# EAGLE schematic EMG_Shield_v.1.2 (EAGLE 6.2)
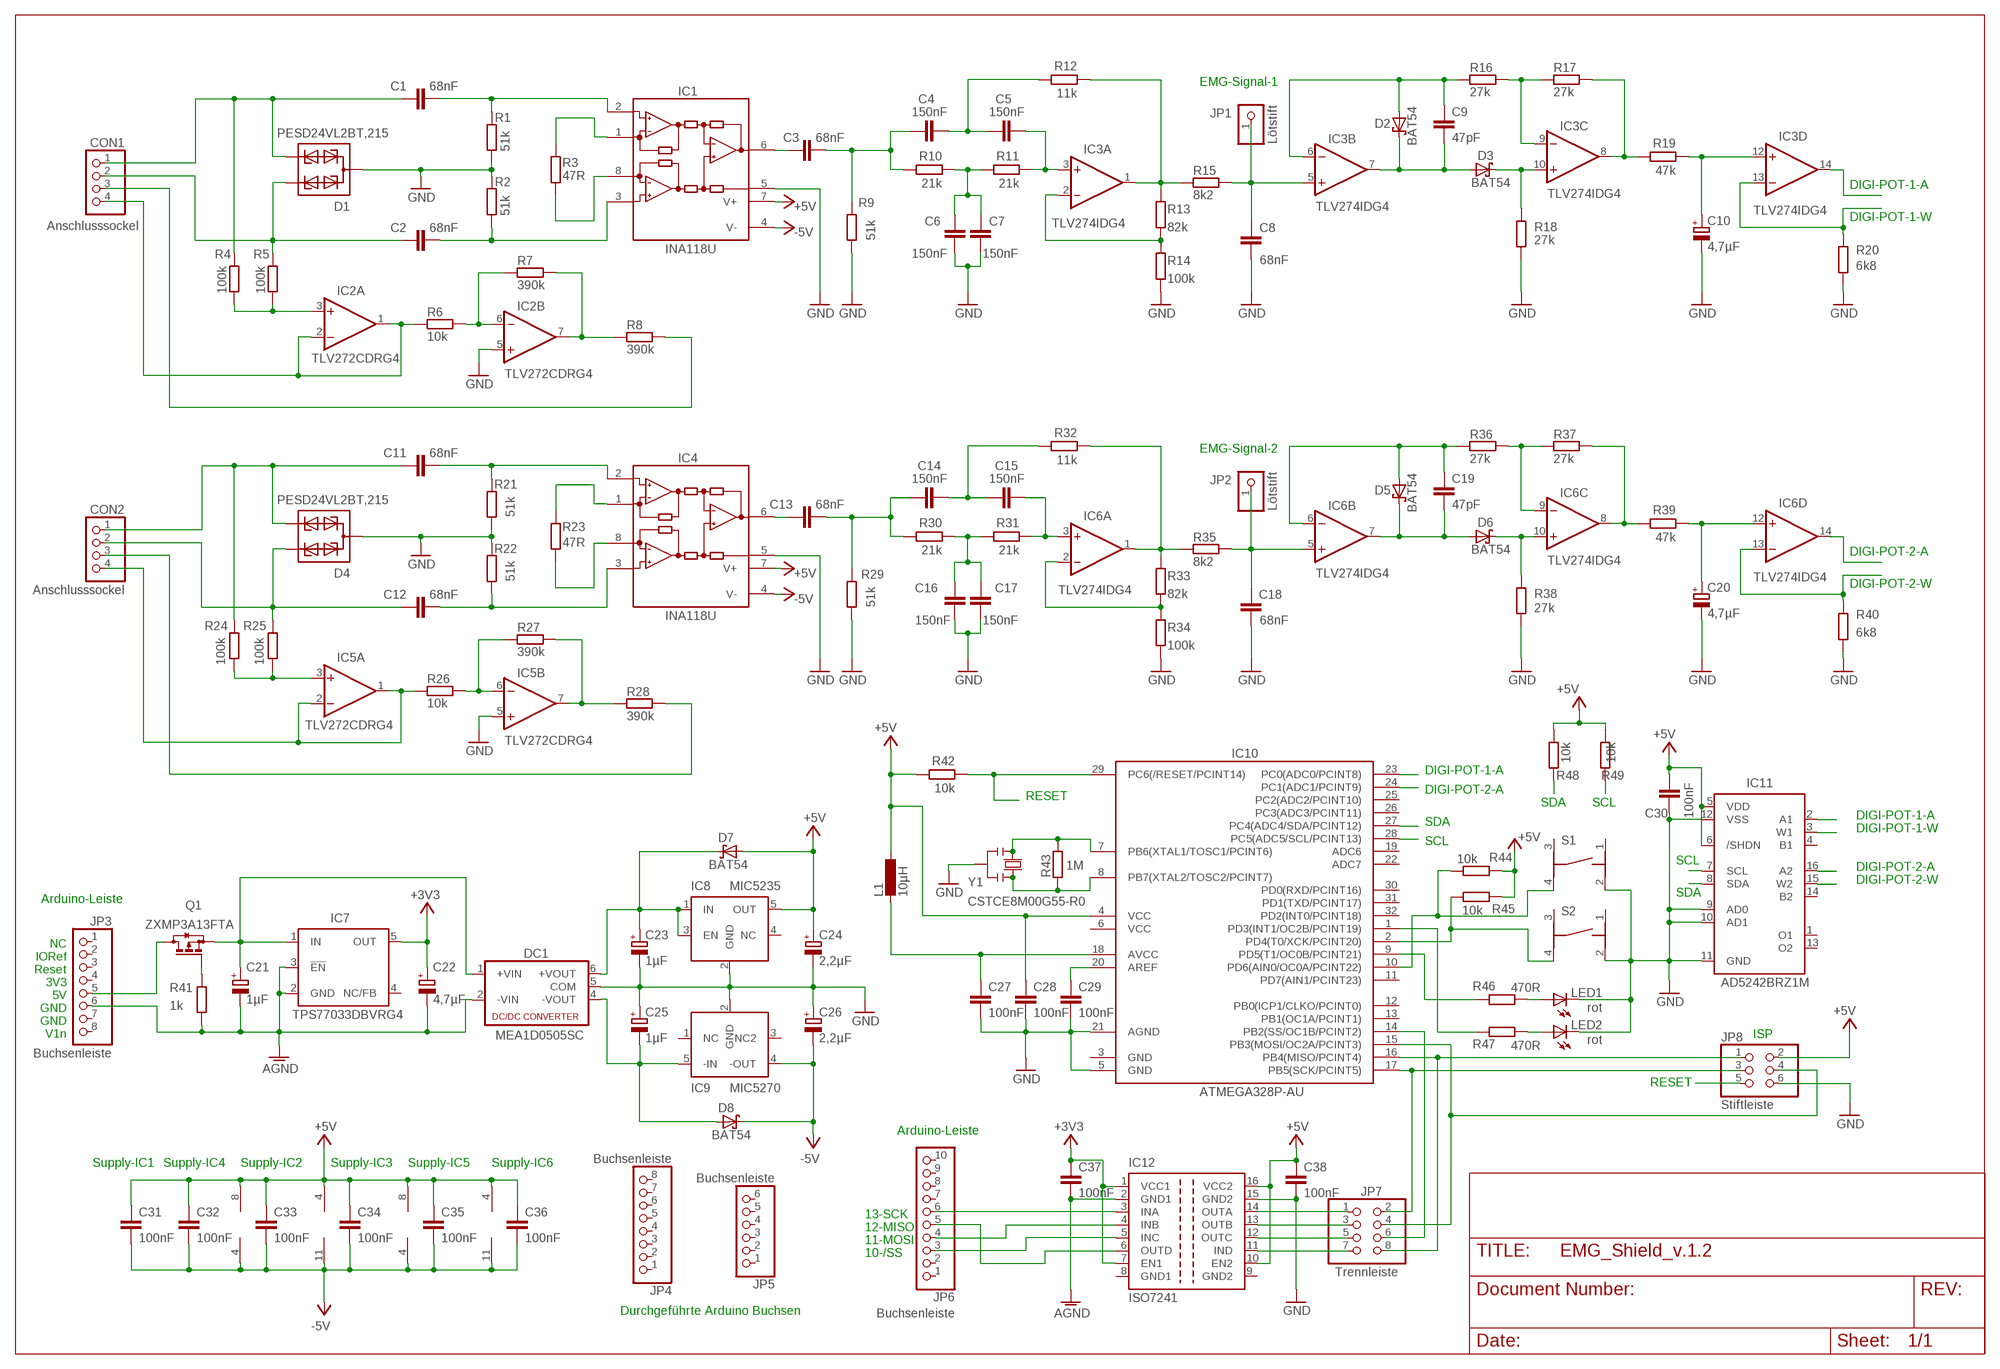
[diagram p0: schematic, sheet 1]

## Parts
C1  68nF  C-EUC0603  [C0603]
C2  68nF  C-EUC0603  [C0603]
C3  68nF  C-EUC0603  [C0603]
C4  150nF  C-EUC0603  [C0603]
C5  150nF  C-EUC0603  [C0603]
C6  150nF  C-EUC0603  [C0603]
C7  150nF  C-EUC0603  [C0603]
C8  68nF  C-EUC0603  [C0603]
C9  47pF  C-EUC0603  [C0603]
C10  4,7µF  CPOL-EUCT3216  [CT3216]
C11  68nF  C-EUC0603  [C0603]
C12  68nF  C-EUC0603  [C0603]
C13  68nF  C-EUC0603  [C0603]
C14  150nF  C-EUC0603  [C0603]
C15  150nF  C-EUC0603  [C0603]
C16  150nF  C-EUC0603  [C0603]
C17  150nF  C-EUC0603  [C0603]
C18  68nF  C-EUC0603  [C0603]
C19  47pF  C-EUC0603  [C0603]
C20  4,7µF  CPOL-EUCT3216  [CT3216]
C21  1µF  CPOL-EUCT3216  [CT3216]
C22  4,7µF  CPOL-EUCT3216  [CT3216]
C23  1µF  CPOL-EUCT3216  [CT3216]
C24  2,2µF  CPOL-EUCT3216  [CT3216]
C25  1µF  CPOL-EUCT3216  [CT3216]
C26  2,2µF  CPOL-EUCT3216  [CT3216]
C27  100nF  C-EUC0603  [C0603]
C28  100nF  C-EUC0603  [C0603]
C29  100nF  C-EUC0603  [C0603]
C30  100nF  C-EUC0603  [C0603]
C31  100nF  C-EUC0603  [C0603]
C32  100nF  C-EUC0603  [C0603]
C33  100nF  C-EUC0603  [C0603]
C34  100nF  C-EUC0603  [C0603]
C35  100nF  C-EUC0603  [C0603]
C36  100nF  C-EUC0603  [C0603]
C37  100nF  C-EUC0603  [C0603]
C38  100nF  C-EUC0603  [C0603]
CON1  Anschlusssockel  PINHD-1X4/90  [1X04/90]
CON2  Anschlusssockel  PINHD-1X4/90  [1X04/90]
D1  PESD24VL2BT,215  PESD5V0S2BT  [SOT23]
D2  BAT54  [SOT23]
D3  BAT54  [SOT23]
D4  PESD24VL2BT,215  PESD5V0S2BT  [SOT23]
D5  BAT54  [SOT23]
D6  BAT54  [SOT23]
D7  BAT54  [SOT23]
D8  BAT54  [SOT23]
DC1  MEA1D0505SC  NMA  [NMA]
IC1  INA118U  [SO08]
IC2  TLV272CDRG4  TLC272D  [SO08]
IC3  TLV274IDG4  TLC274D  [SO14]
IC4  INA118U  [SO08]
IC5  TLV272CDRG4  TLC272D  [SO08]
IC6  TLV274IDG4  TLC274D  [SO14]
IC7  TPS77033DBVRG4  TPS77033  [SOT23-DBV]
IC8  MIC5235  [SOT23-5]
IC9  MIC5270  [SOT23-5]
IC10  ATMEGA328P-AU  ATMEGA48/88/168-AU  [TQFP32-08]
IC11  AD5242BRZ1M  AD5242  [SOIC16N]
IC12  ISO7241  [SO-16DW]
JP1  Lötstift  PINHD-1X1  [1X01]
JP2  Lötstift  PINHD-1X1  [1X01]
JP3  Buchsenleiste  SMARTPRJ_PINHD-1X8TH  [SMARTPRJ_1X08-TH]
JP4  Buchsenleiste  SMARTPRJ_PINHD-1X8TH  [SMARTPRJ_1X08-TH]
JP5  Buchsenleiste  SMARTPRJ_PINHD-1X6TH  [SMARTPRJ_1X06-TH]
JP6  Buchsenleiste  SMARTPRJ_PINHD-1X10_ARD  [SMARTPRJ_1X10]
JP7  Trennleiste  PINHD-2X4  [2X04]
JP8  Stiftleiste  PINHD-2X3  [2X03]
L1  10µH  L-SMD-0805  [R0805]
LED1  rot  LEDCHIP-LED0805  [CHIP-LED0805]
LED2  rot  LEDCHIP-LED0805  [CHIP-LED0805]
Q1  ZXMP3A13FTA  BSS84  [SOT23]
R1  51k  R-EU_R0603  [R0603]
R2  51k  R-EU_R0603  [R0603]
R3  47R  R-EU_R0603  [R0603]
R4  100k  R-EU_R0603  [R0603]
R5  100k  R-EU_R0603  [R0603]
R6  10k  R-EU_R0603  [R0603]
R7  390k  R-EU_R0603  [R0603]
R8  390k  R-EU_R0603  [R0603]
R9  51k  R-EU_R0603  [R0603]
R10  21k  R-EU_R0603  [R0603]
R11  21k  R-EU_R0603  [R0603]
R12  11k  R-EU_R0603  [R0603]
R13  82k  R-EU_R0603  [R0603]
R14  100k  R-EU_R0603  [R0603]
R15  8k2  R-EU_R0603  [R0603]
R16  27k  R-EU_R0603  [R0603]
R17  27k  R-EU_R0603  [R0603]
R18  27k  R-EU_R0603  [R0603]
R19  47k  R-EU_R0603  [R0603]
R20  6k8  R-EU_R0603  [R0603]
R21  51k  R-EU_R0603  [R0603]
R22  51k  R-EU_R0603  [R0603]
R23  47R  R-EU_R0603  [R0603]
R24  100k  R-EU_R0603  [R0603]
R25  100k  R-EU_R0603  [R0603]
R26  10k  R-EU_R0603  [R0603]
R27  390k  R-EU_R0603  [R0603]
R28  390k  R-EU_R0603  [R0603]
R29  51k  R-EU_R0603  [R0603]
R30  21k  R-EU_R0603  [R0603]
R31  21k  R-EU_R0603  [R0603]
R32  11k  R-EU_R0603  [R0603]
R33  82k  R-EU_R0603  [R0603]
R34  100k  R-EU_R0603  [R0603]
R35  8k2  R-EU_R0603  [R0603]
R36  27k  R-EU_R0603  [R0603]
R37  27k  R-EU_R0603  [R0603]
R38  27k  R-EU_R0603  [R0603]
R39  47k  R-EU_R0603  [R0603]
R40  6k8  R-EU_R0603  [R0603]
R41  1k  R-EU_R0603  [R0603]
R42  10k  R-EU_R0603  [R0603]
R43  1M  R-EU_R0603  [R0603]
R44  10k  R-EU_R0603  [R0603]
R45  10k  R-EU_R0603  [R0603]
R46  470R  R-EU_R0603  [R0603]
R47  470R  R-EU_R0603  [R0603]
R48  10k  R-EU_R0603  [R0603]
R49  10k  R-EU_R0603  [R0603]
S1  TASTER-9314_SMD  [TASTER-9314_SMD]
S2  TASTER-9314_SMD  [TASTER-9314_SMD]
Y1  CSTCE8M00G55-R0  SMARTPRJ_RESONATORMU  [SMARTPRJ_RESONATOR]

## Nets
+3V3: C22.+ C37.1 IC7.5(OUT) IC12.1(VCC1) IC12.7(EN1)
+5V: C24.+ C28.1 C30.1 C31.1 C32.1 C33.1 C34.1 C35.1 C36.1 C38.1 D7.1(A) IC1.7(V+) IC2.8(P:V+) IC3.4(P:V+) IC4.7(V+) IC5.8(P:V+) IC6.4(P:V+) IC8.5(OUT) IC10.4(VCC) IC11.5(VDD) IC11.6(/SHDN) IC12.10(EN2) IC12.16(VCC2) JP8.2 L1.1 R42.2 R44.2 R45.2 R48.1 R49.1
-5V: C26.- C31.2 C32.2 C33.2 C34.2 C35.2 C36.2 D8.3(C) IC1.4(V-) IC2.4(P:V-) IC3.11(P:V-) IC4.4(V-) IC5.4(P:V-) IC6.11(P:V-) IC9.4(-OUT)
AGND: C21.- C22.- C37.2 DC1.2(-VIN) IC7.2(GND) IC7.3(!EN) IC12.2(GND1) JP3.6 R41.2
DIGI-POT-1-A: IC3.14(D:OUT) IC10.23(PC0(ADC0/PCINT8)) IC11.2(A1)
DIGI-POT-1-W: IC3.13(D:-IN) IC11.3(W1) R20.1
DIGI-POT-2-A: IC6.14(D:OUT) IC10.24(PC1(ADC1/PCINT9)) IC11.16(A2)
DIGI-POT-2-W: IC6.13(D:-IN) IC11.15(W2) R40.1
GND: C6.1 C7.1 C8.1 C10.- C16.1 C17.1 C18.1 C20.- C23.- C24.- C25.+ C26.+ C27.2 C28.2 C29.2 C30.2 C38.2 D1.3(GROUND) D4.3(GROUND) DC1.5(COM) IC1.5(REF) IC2.5(B:+IN) IC4.5(REF) IC5.5(B:+IN) IC8.2(GND) IC9.2(GND) IC10.5(GND) IC10.21(AGND) IC11.9(AD0) IC11.10(AD1) IC11.11(GND) IC11.12(VSS) IC12.15(GND2) JP8.6 LED1.C LED2.C R1.1 R2.2 R9.1 R14.2 R18.1 R20.2 R21.1 R22.2 R29.1 R34.2 R38.1 R40.2 S1.2 S2.2 Y1.2
N$1: C1.1 CON1.1 D1.2(PROTECT2) R4.2
N$2: IC1.1(RG) R3.1
N$3: C1.2 IC1.2(-IN) R1.2
N$4: CON1.4 IC2.1(A:OUT) IC2.2(A:-IN) R6.1
N$5: C2.2 IC1.3(+IN) R2.1
N$6: C2.1 CON1.2 D1.1(PROTECT1) R5.2
N$7: IC2.6(B:-IN) R6.2 R7.1
N$8: IC2.3(A:+IN) R4.1 R5.1
N$9: IC2.7(B:OUT) R7.2 R8.1
N$10: CON1.3 R8.2
N$11: IC4.1(RG) R23.1
N$12: IC10.14(PB2(SS/OC1B/PCINT2)) JP7.6
N$13: IC1.8(RG) R3.2
N$14: C11.1 CON2.1 D4.2(PROTECT2) R24.2
N$15: C3.1 IC1.6(OUT)
N$16: C3.2 C4.1 R9.2 R10.2
N$17: IC3.1(A:OUT) R12.1 R13.1 R15.1
N$18: C4.2 C5.1 R12.2
N$19: C5.2 IC3.3(A:+IN) R11.1
N$20: C6.2 C7.2 R10.1 R11.2
N$21: IC3.2(A:-IN) R13.2 R14.1
N$22: C11.2 IC4.2(-IN) R21.2
N$23: C8.2 IC3.5(B:+IN) JP1.1 R15.2
N$24: C9.2 D2.3(C) D3.1(A) IC3.7(B:OUT)
N$25: D3.3(C) IC3.10(C:+IN) R18.2
N$26: C9.1 D2.1(A) IC3.6(B:-IN) R16.1
N$27: IC3.9(C:-IN) R16.2 R17.1
N$28: IC3.8(C:OUT) R17.2 R19.2
N$29: C10.+ IC3.12(D:+IN) R19.1
N$30: C21.+ DC1.1(+VIN) IC7.1(IN) Q1.2(S)
N$31: C12.2 IC4.3(+IN) R22.1
N$32: C12.1 CON2.2 D4.1(PROTECT1) R25.2
N$33: IC5.3(A:+IN) R24.1 R25.1
N$34: CON2.4 IC5.1(A:OUT) IC5.2(A:-IN) R26.1
N$35: IC5.6(B:-IN) R26.2 R27.1
N$36: IC5.7(B:OUT) R27.2 R28.1
N$37: CON2.3 R28.2
N$38: IC12.14(OUTA) JP7.1
N$39: IC12.4(INB) JP6.4
N$40: IC4.8(RG) R23.2
N$41: IC12.13(OUTB) JP7.3
N$42: C13.1 IC4.6(OUT)
N$43: C13.2 C14.1 R29.2 R30.2
N$44: C14.2 C15.1 R32.2
N$45: C15.2 IC6.3(A:+IN) R31.1
N$46: C16.2 C17.2 R30.1 R31.2
N$47: IC6.1(A:OUT) R32.1 R33.1 R35.1
N$48: IC6.2(A:-IN) R33.2 R34.1
N$49: C18.2 IC6.5(B:+IN) JP2.1 R35.2
N$50: C19.2 D5.3(C) D6.1(A) IC6.7(B:OUT)
N$51: D6.3(C) IC6.10(C:+IN) R38.2
N$52: C19.1 D5.1(A) IC6.6(B:-IN) R36.1
N$53: IC6.9(C:-IN) R36.2 R37.1
N$54: IC6.8(C:OUT) R37.2 R39.2
N$55: C20.+ IC6.12(D:+IN) R39.1
N$56: C23.+ D7.3(C) DC1.6(+VOUT) IC8.1(IN) IC8.3(EN)
N$57: JP3.5 Q1.3(D)
N$58: IC10.9(PD5(T1/OC0B/PCINT21)) R46.2
N$59: C25.- D8.1(A) DC1.4(-VOUT) IC9.5(-IN)
N$60: IC10.10(PD6(AIN0/OC0A/PCINT22)) R44.1 S1.4
N$61: Q1.1(G) R41.1
N$62: IC10.2(PD4(T0/XCK/PCINT20)) R45.1 S2.4
N$63: LED1.A R46.1
N$64: IC10.1(PD3(INT1/OC2B/PCINT19)) R47.2
N$65: LED2.A R47.1
N$66: IC12.6(OUTD) JP6.5
N$67: IC10.17(PB5(SCK/PCINT5)) JP7.2 JP8.3
N$68: IC10.15(PB3(MOSI/OC2A/PCINT3)) JP7.4 JP8.4
N$69: IC12.12(OUTC) JP7.5
N$70: IC10.16(PB4(MISO/PCINT4)) JP7.8 JP8.1
N$71: IC12.3(INA) JP6.6
N$72: IC12.5(INC) JP6.3
N$73: IC12.11(IND) JP7.7
N$74: C27.1 IC10.18(AVCC) L1.2
N$75: IC10.7(PB6(XTAL1/TOSC1/PCINT6)) R43.1 Y1.1
N$76: IC10.8(PB7(XTAL2/TOSC2/PCINT7)) R43.2 Y1.3
N$83: C29.1 IC10.20(AREF)
RESET: IC10.29(PC6(/RESET/PCINT14)) JP8.5 R42.1
SCL: IC10.28(PC5(ADC5/SCL/PCINT13)) IC11.7(SCL) R49.2
SDA: IC10.27(PC4(ADC4/SDA/PCINT12)) IC11.8(SDA) R48.2
Unconnected: IC7.4(NC/FB) IC8.4(NC) IC9.1(NC) IC9.3(NC2) IC10.11(PD7(AIN1/PCINT23)) IC10.12(PB0(ICP1/CLKO/PCINT0)) IC10.13(PB1(OC1A/PCINT1)) IC10.19(ADC6) IC10.22(ADC7) IC10.25(PC2(ADC2/PCINT10)) IC10.26(PC3(ADC3/PCINT11)) IC10.30(PD0(RXD/PCINT16)) IC10.31(PD1(TXD/PCINT17)) IC10.32(PD2(INT0/PCINT18)) IC11.1(O1) IC11.4(B1) IC11.13(O2) IC11.14(B2) JP3.1 JP3.2 JP3.3 JP3.4 JP3.7 JP3.8 JP4.1 JP4.2 JP4.3 JP4.4 JP4.5 JP4.6 JP4.7 JP4.8 JP5.1 JP5.2 JP5.3 JP5.4 JP5.5 JP5.6 JP6.1 JP6.2 JP6.7 JP6.8 JP6.9 JP6.10 S1.1 S1.3 S2.1 S2.3

## Notes on the sheet
- EMG-Signal-1
- DIGI-POT-1-A
- DIGI-POT-1-W
- EMG-Signal-2
- DIGI-POT-2-A
- DIGI-POT-2-W
- DIGI-POT-1-A
- DIGI-POT-2-A
- RESET
- SDA | SCL
- DIGI-POT-1-A
- SDA
- DIGI-POT-1-W
- SCL
- SCL
- DIGI-POT-2-A
- DIGI-POT-2-W
- SDA
- Arduino-Leiste
- NC
- IORef
- Reset
- 3V3
- 5V
- GND
- GND
- V1n | ISP
- RESET
- Arduino-Leiste
- Supply-IC1 | Supply-IC4 | Supply-IC2 | Supply-IC3 | Supply-IC5 | Supply-IC6
- 13-SCK
- 12-MISO
- 11-MOSI
- 10-/SS
- Durchgeführte Arduino Buchsen

## Power pins joined to a net without a drawn wire
GND: IC10.3(GND)
GND1: IC12.8(GND1)
GND2: IC12.9(GND2)
VCC: IC10.6(VCC)

## Library data of the parts
C1-C8 C11-C18 = rcl:C-EU: CAPACITOR, European symbol
C9 C19 C27-C38 = resistor:C-EU: CAPACITOR, European symbol
C10 C20-C26 = rcl:CPOL-EU: POLARIZED CAPACITOR, European symbol
CON1 CON2 = pinhead:PINHD-1X4: PIN HEADER
D1 D4 = diode:PESD5V0S2BT: Bi-Direct ESD Protection Diode, Minimum Breakdown Voltage = 5,5V
D2 D3 D5-D8 = diode:BAT54: Schottky Diodes Source: Fairchild .. BAT54.pdf
DC1 = dc-dc-converter:NMA: DC-DC CONVERTER; MF: C & D TECHNOLOGIES, INC; MPN: NMA0515SC; OC_FARNELL: 1021434; OC_NEWARK: 61K3064
IC1 IC4 = burr-brown:INA118: Instrumentation Amplifier Precision, Low Power; MF: TEXAS INSTRUMENTS; MPN: INA118U; OC_FARNELL: 1212404; OC_NEWARK: 04M6168
IC2 IC5 = linear:TLC272: OP AMP
IC3 IC6 = linear:TLC274: OP AMP
IC7 = texas:TPS770*: ULTRALOW-POWER 50-mA LOW-DROPOUT LINEAR REGULATORS 50-mA Low-Dropout Regulator Source: http://focus.ti.com/lit/ds/symlink/tps77001.pdf; MF: TEXAS INSTRUMENTS; MPN: TPS77033DBVT; OC_FARNELL: 8461570; OC_NEWARK: 77C1187
IC8 = v-reg-micrel:MIC5235
IC9 = v-reg-micrel:MIC5270
IC10 = atmega8:ATMEGA48/88/168
IC11 = analog-devices:AD5242
IC12 = texas:ISO7241: HIGH SPEED QUAD DIGITAL ISOLATORS Source: http://focus.ti.com/lit/ds/symlink/iso7240m.pdf; MPN: ISO7241CDW; OC_FARNELL: 1575372; OC_NEWARK: 73M3155
JP1 JP2 = pinhead:PINHD-1X1: PIN HEADER
JP3 JP4 = arduino_Uno_Rev3-02-TH:SMARTPRJ_PINHD-1X8: PIN HEADER
JP5 = arduino_Uno_Rev3-02-TH:SMARTPRJ_PINHD-1X6: PIN HEADER
JP6 = arduino_Uno_Rev3-02-TH:SMARTPRJ_PINHD-1X10_ARD: PIN HEADER
JP7 = pinhead:PINHD-2X4: PIN HEADER
JP8 = pinhead:PINHD-2X3: PIN HEADER
L1 = rcl:L-SMD-0805
LED1 LED2 = led:LED: LED OSRAM: - CHIPLED LG R971, LG N971, LY N971, LG Q971, LY Q971, LO R971, LY R971 LH N974, LH R974 LS Q976, LO Q976, LY Q976 LO Q996 - Hyper CHIPLED LW Q18S LB Q993, LB Q99A, LB R99A - SideLED LS A670, LO A670, LY A670, LG A670, LP A670 LB A673, LV A673, LT A673, LW A673 LH A674 LY A675 LS A676, LA A676, LO A676, LY A676, LW A676 LS A679, LY A679, LG A679 - Hyper Micro SIDELED® LS Y876, LA Y876, LO Y876, LY Y876 LT Y87S - SmartLED LW L88C, LW L88S LB L89C, LB L89S, LG L890 LS L89K, LO L89K, LY L89K LS L896, LA L896, LO L896, LY L896 - TOPLED LS T670, LO T670, LY T670, LG T670, LP T670 LSG T670, LSP T670, LSY T670, LOP T670, LYG T670 LG T671, LOG T671, LSG T671 LB T673, LV T673, LT T673, LW T673 LH T674 LS T676, LA T676, LO T676, LY T676, LB T676, LH T676, LSB T676, LW T676 LB T67C, LV T67C, LT T67C, LS T67K, LO T67K, LY T67K, LW E67C LS E67B, LA E67B, LO E67B, LY E67B, LB E67C, LV E67C, LT E67C LW T67C LS T679, LY T679, LG T679 LS T770, LO T770, LY T770, LG T770, LP T770 LB T773, LV T773, LT T773, LW T773 LH T774 LS E675, LA E675, LY E675, LS T675 LS T776, LA T776, LO T776, LY T776, LB T776 LHGB T686 LT T68C, LB T68C - Hyper Mini TOPLED® LB M676 - Mini TOPLED Santana® LG M470 LS M47K, LO M47K, LY M47K Source: http://www.osram.convergy.de LUXEON: - LUMILED® LXK2-PW12-R00, LXK2-PW12-S00, LXK2-PW14-U00, LXK2-PW14-V00 LXK2-PM12-R00, LXK2-PM12-S00, LXK2-PM14-U00 LXK2-PE12-Q00, LXK2-PE12-R00, LXK2-PE12-S00, LXK2-PE14-T00, LXK2-PE14-U00 LXK2-PB12-K00, LXK2-PB12-L00, LXK2-PB12-M00, LXK2-PB14-N00, LXK2-PB14-P00, LXK2-PB14-Q00 LXK2-PR12-L00, LXK2-PR12-M00, LXK2-PR14-Q00, LXK2-PR14-R00 LXK2-PD12-Q00, LXK2-PD12-R00, LXK2-PD12-S00 LXK2-PH12-R00, LXK2-PH12-S00 LXK2-PL12-P00, LXK2-PL12-Q00, LXK2-PL12-R00 Source: www.luxeon.com KINGBRIGHT: KA-3528ASYC Source: www.kingbright.com
Q1 = transistor-small-signal:BSS84: P-CHANNEL MOS FET
R1-R49 = resistor:R-EU_: RESISTOR, European symbol
S1 S2 = Ergaenzung:TASTER-9314_SMD
Y1 = arduino_Uno_Rev3-02-TH:SMARTPRJ_RESONATOR